# Altium project control_block.PrjPCB
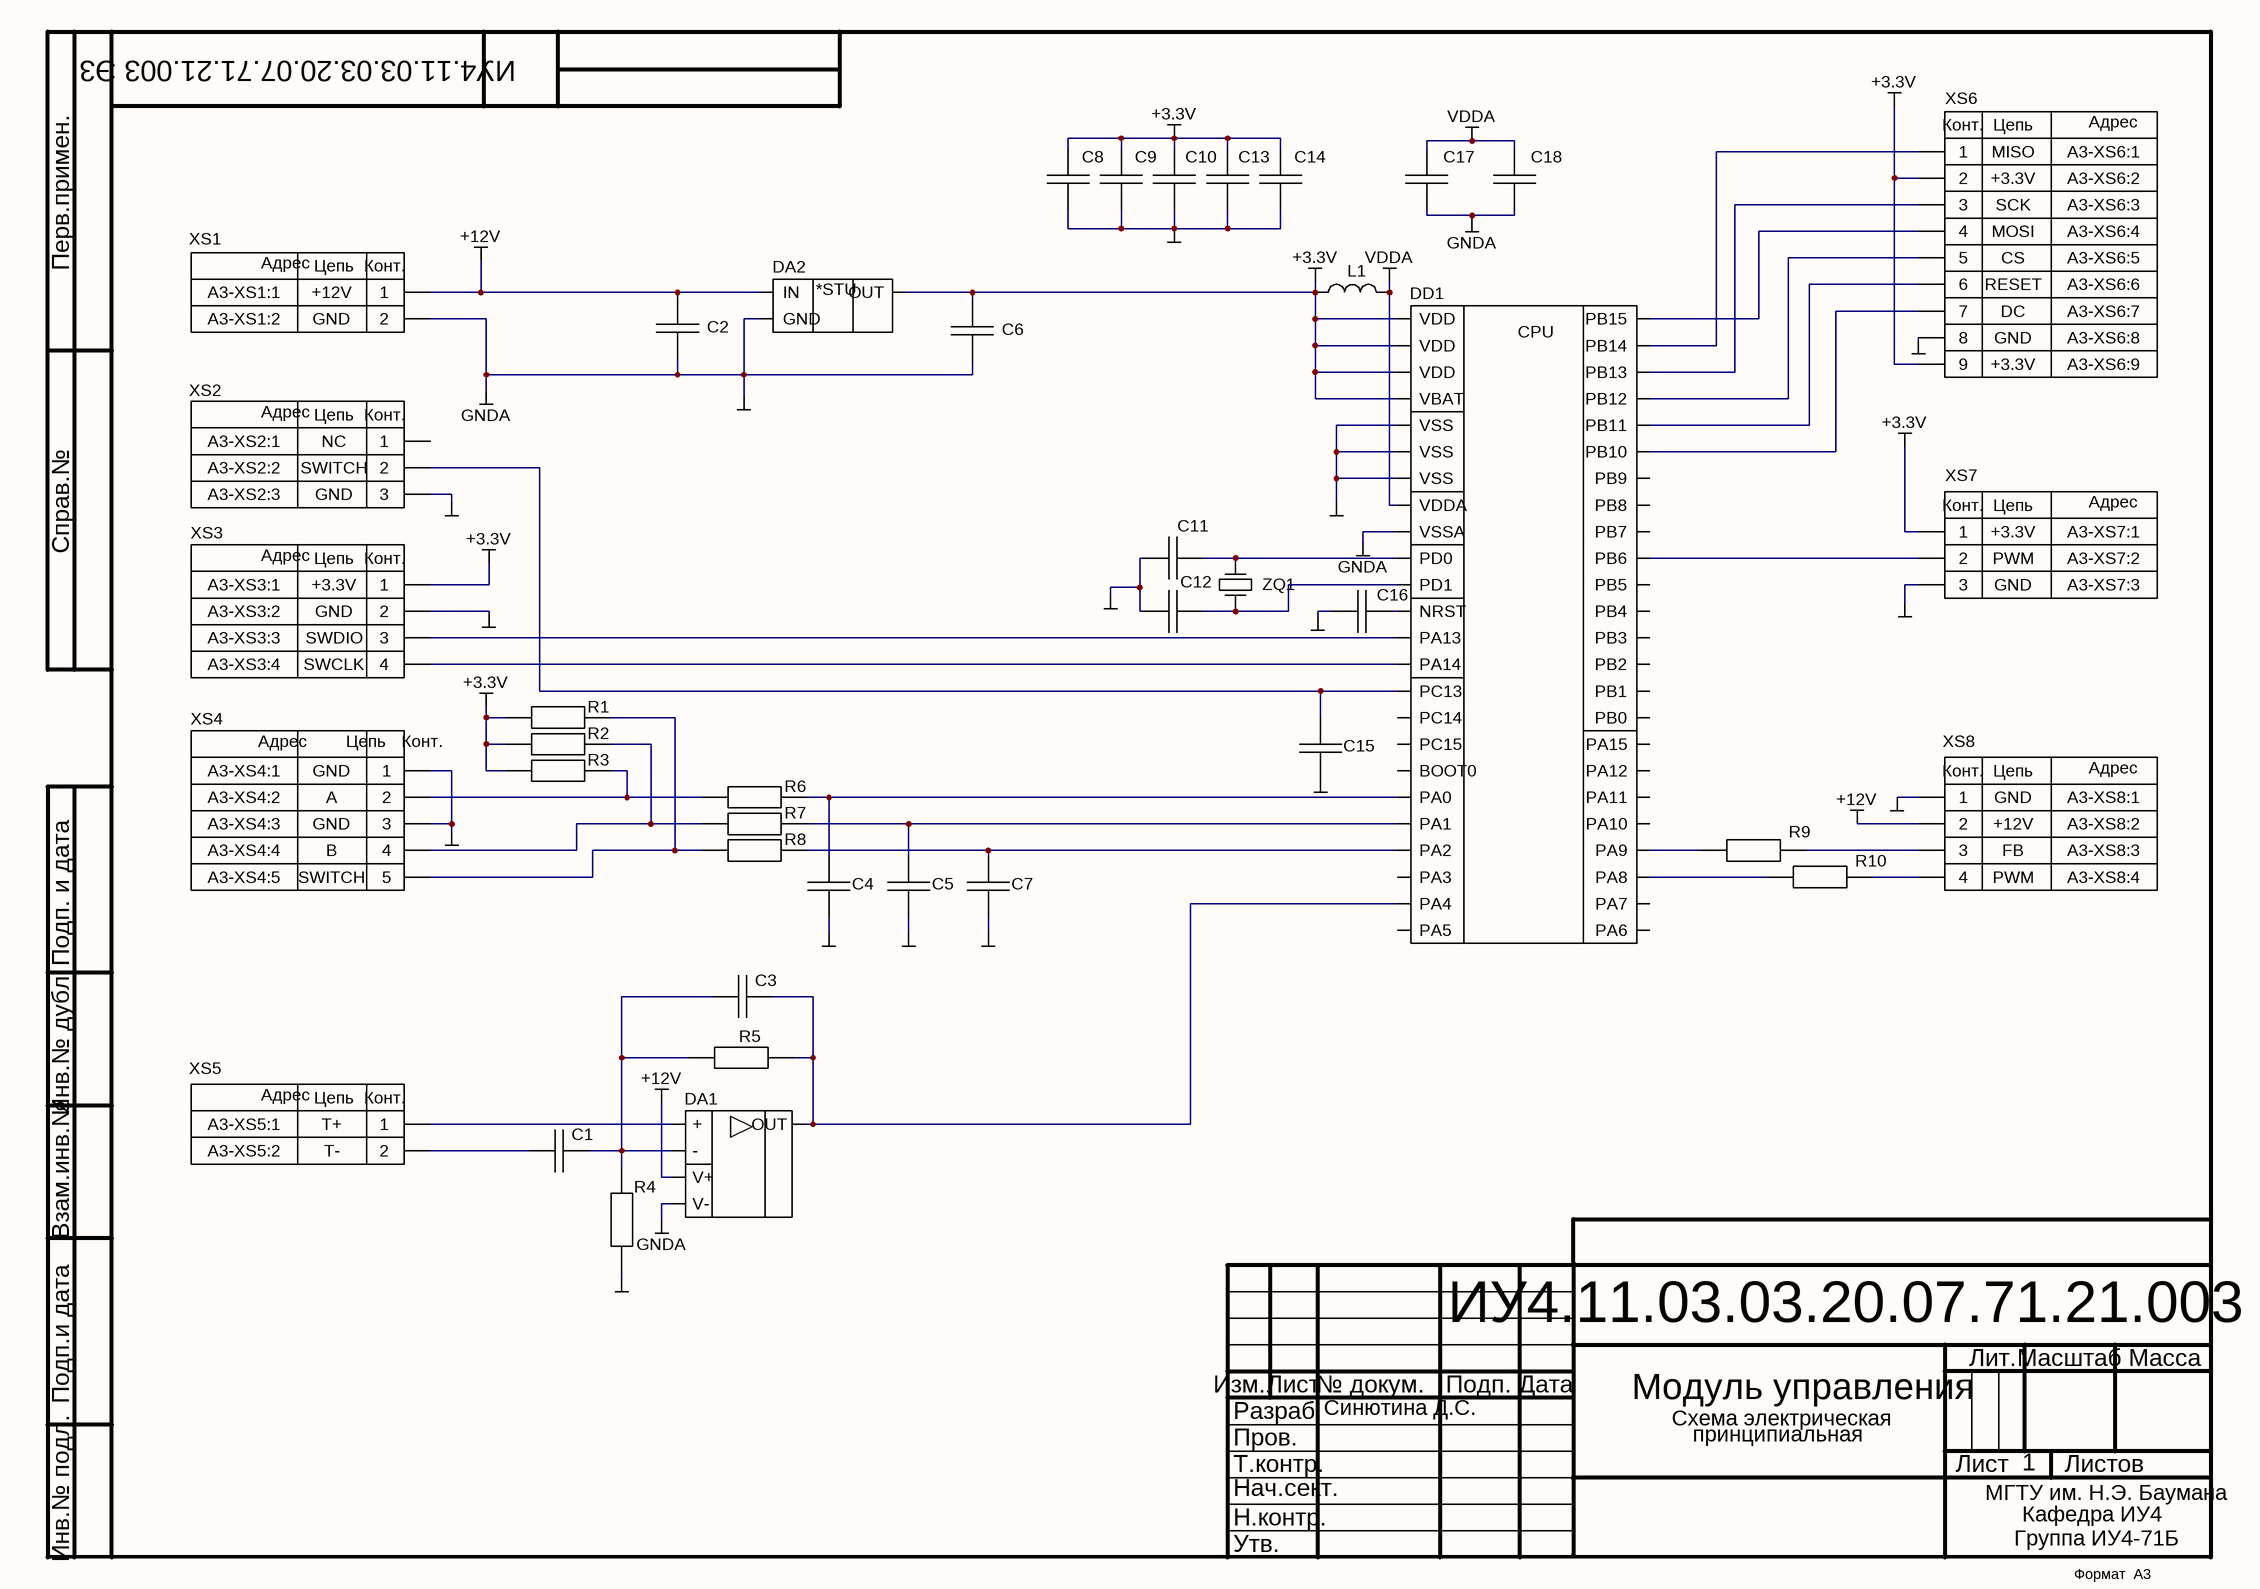
[diagram p0: control_block.SchDoc]
1 sheet, 41 parts. Net scope: global (net labels, ports and power ports of the same name join across sheets).
Board files: control_block.PcbDoc, control_block_mask.PcbDoc

## Sheet control_block.SchDoc
size 420 x 297 mm; SheetNumber: 1; PageSetup: Record=PageOptions|CenterHorizontal=True|CenterVertical=True|PrintScale=0.94|XCorrection=1.00|YCorrection=1.00|PrintKind=1|BorderSize=5000000|LeftOffset=0|BottomOffset=0|Orientation=1|PaperLength=1000|PaperWidth=1000|Scale=100|PaperSource=7|PrintQuality=-4|MediaType=1|DitherType=10|PaperKind=A4|PrintScaleMode=1; DecimalNumber: ИУ4.11.03.03.20.07.71.21.003 Э3

### Parts
C1  100 нФ  [CAP: 0603]  (value not drawn)
C2  330 нФ  [CAP: 0603]  (value not drawn)
C3  100 нФ  [CAP: 0603]  (value not drawn)
C4  100 нФ  [CAP: 0603]  (value not drawn)
C5  100 нФ  [CAP: 0603]  (value not drawn)
C6  100 нФ  [CAP: 0603]  (value not drawn)
C7  100 нФ  [CAP: 0603]  (value not drawn)
C8  100 нФ  [CAP: 0603]  (value not drawn)
C9  100 нФ  [CAP: 0603]  (value not drawn)
C10  100 нФ  [CAP: 0603]  (value not drawn)
C11  22 pF  [CAP: 0603]  (value not drawn)
C12  22 pF  [CAP: 0603]  (value not drawn)
C13  100 нФ  [CAP: 0603]  (value not drawn)
C14  4.7 мкФ  [CAP: 0603]  (value not drawn)
C15  100 нФ  [CAP: 0603]  (value not drawn)
C16  100 нФ  [CAP: 0603]  (value not drawn)
C17  10 нФ  [CAP: 0603]  (value not drawn)
C18  1 мкФ  [CAP: 0603]  (value not drawn)
DA1  TS321ILT  [SOT23-5]  (value not drawn)
DA2  78xx  [SOT89]  (value not drawn)
DD1  STM32F103C8T6  [48-LQFP]  (value not drawn)
L1  10 мкГн  [IND: 0805]  (value not drawn)
R1  10кОм  [RES: 0603]  (value not drawn)
R2  10кОм  [RES: 0603]  (value not drawn)
R3  10кОм  [RES: 0603]  (value not drawn)
R4  1 кОм  [RES: 1206]  (value not drawn)
R5  47 кОм  [RES: 1206]  (value not drawn)
R6  10кОм  [RES: 0603]  (value not drawn)
R7  10кОм  [RES: 0603]  (value not drawn)
R8  10кОм  [RES: 0603]  (value not drawn)
R9  220 Ом  [RES: 1206]  (value not drawn)
R10  220 Ом  [RES: 1206]  (value not drawn)
XS1  circuit2: GND  circuit1: +12V  =address2: A3-XS1:2  =address1: A3-XS1:1  [CON: WF-02]  (hidden comment: X2)
XS2  circuit1: NC  circuit2: SWITCH  circuit3: GND  =address1: A3-XS2:1  =address2: A3-XS2:2  =address3: A3-XS2:3  [CON: WF-03]  (hidden comment: X3)
XS3  circuit2: GND  circuit3: SWDIO  circuit1: +3.3V  circuit4: SWCLK  =address4: A3-XS3:4  =address3: A3-XS3:3  =address2: A3-XS3:2  =address1: A3-XS3:1  [CON: WF-04]  (hidden comment: X4)
XS4  cirtuit5: SWITCH  circuit4: B  circuit3: GND  circuit2: A  =address5: A3-XS4:5  =address4: A3-XS4:4  =address3: A3-XS4:3  =address2: A3-XS4:2  =address1: A3-XS4:1  [CON: CWF-5]  (hidden comment: X5)
XS5  circuit2: T-  circuit1: T+  =address2: A3-XS5:2  =address1: A3-XS5:1  [CON: WF-02]  (hidden comment: X2)
XS6  circtuit9: +3.3V  circtuit8: GND  circtuit7: DC  circtuit6: RESET  circtuit5: CS  circtuit4: MOSI  circtuit3: SCK  circtuit1: MISO  =address9: A3-XS6:9  =address8: A3-XS6:8  =address7: A3-XS6:7  =address5: A3-XS6:5  =address6: A3-XS6:6  =address4: A3-XS6:4  =address3: A3-XS6:3  =address2: A3-XS6:2  =address1: A3-XS6:1  [CON: IDC-10MS]  (hidden comment: X9)
XS7  circuit1: +3.3V  circuit2: PWM  circuit3: GND  =address1: A3-XS7:1  =address2: A3-XS7:2  =address3: A3-XS7:3  [CON: WF-03]  (hidden comment: X3)
XS8  circuit2: +12V  circuit3: FB  circuit1: GND  circuit4: PWM  =address4: A3-XS8:4  =address3: A3-XS8:3  =address2: A3-XS8:2  =address1: A3-XS8:1  [CON: WF-04]  (hidden comment: X4)
ZQ1  AT-41CD2-8MHz  [AT-41CD2]  (value not drawn)

### Nets
+3.3V: C6.2 C8.2 C9.2 C10.2 C13.2 C14.2 DA2.2(OUT) DD1.1(VBAT) DD1.24(VDD) DD1.36(VDD) DD1.48(VDD) L1.1 R1.2 R2.2 R3.2 XS3.1 XS6.2 XS6.9 XS7.1
+12V: C2.2 DA1.5(V+) DA2.1(IN) XS1.1 XS8.2
GND: C2.1 C4.1 C5.1 C6.1 C7.1 C8.1 C9.1 C10.1 C11.1 C12.1 C13.1 C14.1 C15.1 C16.1 C17.1 C18.1 DA1.2(V-) DA2.3(GND) DD1.8(VSSA) DD1.23(VSS) DD1.35(VSS) DD1.47(VSS) R4.2 XS1.2 XS2.3 XS3.2 XS4.1 XS4.3 XS6.8 XS7.3 XS8.1  [also labelled GNDA]
VDDA: C17.2 C18.2 DD1.9(VDDA) L1.2
NetC1_1: C1.1 XS5.2
NetC1_2: C1.2 C3.1 DA1.3(-) R4.1 R5.1
NetC3_2: C3.2 DA1.4(OUT) DD1.14(PA4) R5.2
NetC4_2: C4.2 DD1.10(PA0) R6.2
NetC5_2: C5.2 DD1.11(PA1) R7.2
NetC7_2: C7.2 DD1.12(PA2) R8.2
NetC11_2: C11.2 DD1.5(PD0) ZQ1.1
NetC12_2: C12.2 DD1.6(PD1) ZQ1.2
NetC15_2: C15.2 DD1.2(PC13) XS2.2
NetC16_2: C16.2 DD1.7(NRST)
NetDA1_1: DA1.1(+) XS5.1
NetDD1_21: DD1.21(PB10) XS6.7
NetDD1_22: DD1.22(PB11) XS6.6
NetDD1_25: DD1.25(PB12) XS6.5
NetDD1_26: DD1.26(PB13) XS6.3
NetDD1_27: DD1.27(PB14) XS6.1
NetDD1_28: DD1.28(PB15) XS6.4
NetDD1_29: DD1.29(PA8) R10.1
NetDD1_30: DD1.30(PA9) R9.1
NetDD1_34: DD1.34(PA13) XS3.3
NetDD1_37: DD1.37(PA14) XS3.4
NetDD1_42: DD1.42(PB6) XS7.2
NetR1_1: R1.1 R8.1 XS4.5
NetR2_1: R2.1 R7.1 XS4.4
NetR3_1: R3.1 R6.1 XS4.2
NetR9_2: R9.2 XS8.3
NetR10_2: R10.2 XS8.4

Not connected (* = marked no-connect by the designer): DD1 3(PC14) 4(PC15) 13(PA3) 15(PA5) 16(PA6) 17(PA7) 18(PB0) 19(PB1) 20(PB2) 31(PA10) 32(PA11) 33(PA12) 38(PA15) 39(PB3) 40(PB4) 41(PB5) 43(PB7) 44(BOOT0) 45(PB8) 46(PB9); XS2 1

### Notes on the sheet
- Модуль управления
- Синютина Д.С.
- Схема электрическая
- принципиальная
- МГТУ им. Н.Э. Баумана
- Кафедра ИУ4
- Группа ИУ4-71Б
- Перв.примен.
- Справ.№
- Подп. и дата
- Инв.№ дубл.
- Взам.инв.№
- Подп.и дата
- Разраб.
- Изм.
- Лист
- № докум.
- Подп.
- Дата
- Лит.
- Масштаб
- Масса
- Т.контр.
- Пров.
- Листов
- Инв.№ подл.
- Утв.
- Н.контр.
- Нач.сект.
- Формат  A3
- (in symbol 78xx) *STU
- (in symbol STM32F103C8T6) CPU
- (in symbol X2) Цепь; Конт.; Адрес
- (in symbol X3) Цепь; Конт.; Адрес
- (in symbol X4) Конт.; Цепь; Адрес
- (in symbol X5) Адрес; Цепь; Конт.
- (in symbol X9) Конт.; Цепь; Адрес

### Library data of the parts
C1-C18 = C_const
DA1 = single_channel_op_amp: pin to pad: 1>3 3>4 4>1
DA2 = 78xx: pin to pad: 1>3 2>1 3>2
L1 = L
R1-R10 = Res
XS5 = X2: pin to pad: 1>2 2>1
ZQ1 = ZQ
XS4 = X5: circuit1: GND
XS6 = X9: circtuit2: +3.3V